# Altium schematic sheet reset.SchDoc: Reset
size Letter; CheckedBy: J. Brinton; CompanyName: Signal Laboratories, Inc.; DrawnBy: J. Brinton; Engineer: J. Brinton; Address1: 3479 Edison Way; Address2: Menlo Park CA 94025; Address3: +1 (877) 778-8435; Address4: siglabs.com; Revision: 3; SheetNumber: 39; SheetTotal: 49
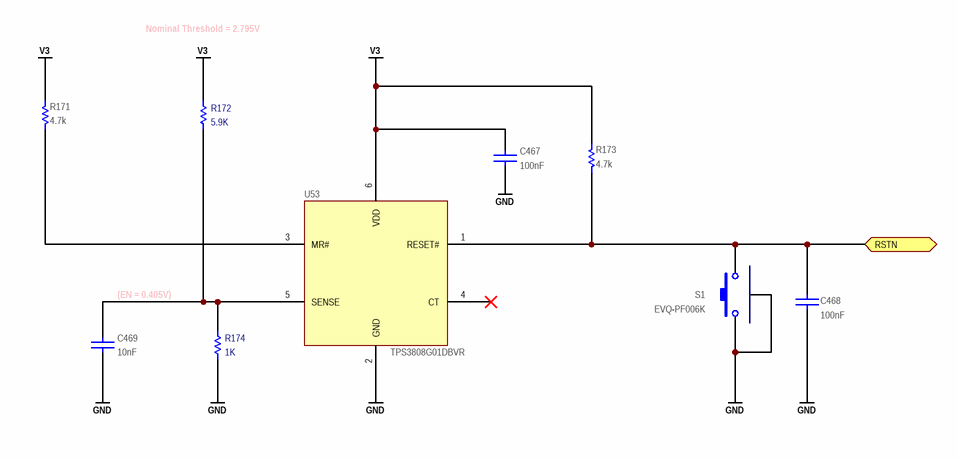
[diagram p0: reset.SchDoc]

## Parts
C467  value 100nF  [CAPC100X50X55L25N]  (hidden comment: GCM155R71H104KE02)
C468  value 100nF  [CAPC100X50X55L25N]  (hidden comment: GCM155R71H104KE02)
C469  value 10nF  [CAPC100X50X55L25N]  (hidden comment: GRM155R71H103KA88)
R171  value 4.7k  [RESC1005X40N]  (hidden comment: ERJ-2RKF4701X)
R172  value 5.9K  [RESC1005X40N]  (hidden comment: RC0402FR-075K9L)
R173  value 4.7k  [RESC1005X40N]  (hidden comment: ERJ-2RKF4701X)
R174  value 1K  [RESC1005X40N]  (hidden comment: RC0402FR-071KL)
S1  EVQ-PF006K  [EVQ-PF006K]
U53  TPS3808G01DBVR  [DBV-6]

## Ports
RSTN (bidir)

## Nets
GND: C467.2 C468.1 C469.2 R174.1 S1.1 S1.3 U53.2(GND)
V3: C467.1 R171.2 R172.2 R173.2 U53.6(VDD)
RSTN: C468.2 R173.1 S1.2 U53.1(RESET#) ; port RSTN
NetC469_1: C469.1 R172.1 R174.2 U53.5(SENSE)
NetR171_1: R171.1 U53.3(MR#)

Not connected (* = marked no-connect by the designer): U53 4(CT)*

## Notes on the sheet
- Nominal Threshold = 2.795V
- (EN = 0.405V)
- Title
- Engineer
- Revision
- Drawn By
- Checked By
- Date
- Sheet
- of

## Library data of the parts
C467 C468 = CAP: Ceramic Capacitor 100nF ±10% 50V X7R 0402; Manufacturer: Murata; Tr: -55:125; Manufacturer P/N: GCM155R71H104KE02; Tolerance: ±10%; Voltage: 50V; Package: 0402
  C468: Footprint: *
C469 = CAP: Ceramic Capacitor 10nF ±10% 50V X7R 0402; Manufacturer: Murata; Tr: -55:125; Manufacturer P/N: GRM155R71H103KA88; Tolerance: ±10%; Voltage: 50V; Package: 0402
R171 R173 = RES: Thick Film Resistor 4.7k ±1% 0.1W 75V 0402; Manufacturer: Panasonic; Tcr: ±100; Tr: -55:155; Voltage: 75; Power: 0.1; Tolerance: ±1%; Manufacturer P/N: ERJ-2RKF4701X; Alternatives: *; Footprint: *; Package: 0402
R172 = RES 0402: Thick Film Resistor 5.9k ±1% 0402; Manufacturer: Yageo; Tr: -55:155; Package: 0402; Manufacturer P/N: RC0402FR-075K9L; Do Not Place: *; Tolerance: ±1%
R174 = RES 0402: Thick Film Resistor 1k ±1% 0402; Manufacturer: Yageo; Tr: -55:155; Package: 0402; Manufacturer P/N: RC0402FR-071KL; Do Not Place: *; Tolerance: ±1%
S1 = EVQ-PF006K: Tactile Switch; Normally Open; Manufacturer: Panasonic; Manufacturer P/N: EVQ-PF006K
U53 = TPS3808: Low Quiescent Current, Programmable-Delay  Supervisory Circuit; Manufacturer: Texas Instruments; Manufacturer P/N: TPS3808G01DBVR